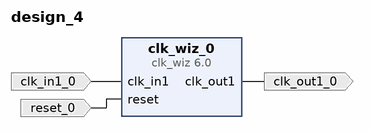
[diagram p0: block diagram of the top level]
# Vivado block design design_4, xc7a35tcpg236-1, Vivado 2024.2
create_bd_design design_4

create_bd_port -dir I -type clk clk_in1_0
set_property -dict {CONFIG.FREQ_HZ 12000000} [get_bd_ports clk_in1_0]
create_bd_port -dir O -type clk clk_out1_0
create_bd_port -dir I -type rst reset_0
set_property -dict {CONFIG.POLARITY ACTIVE_HIGH} [get_bd_ports reset_0]

create_bd_cell -type ip -vlnv xilinx.com:ip:clk_wiz:6.0 clk_wiz_0
set_property -dict [list \
  CONFIG.CLKOUT1_JITTER 555.020 \
  CONFIG.CLKOUT1_PHASE_ERROR 674.235 \
  CONFIG.CLKOUT1_REQUESTED_OUT_FREQ 30 \
  CONFIG.MMCM_CLKFBOUT_MULT_F 63.750 \
  CONFIG.MMCM_CLKOUT0_DIVIDE_F 25.500 \
  CONFIG.MMCM_DIVCLK_DIVIDE 1 \
] [get_bd_cells clk_wiz_0]

# ---- connections ----

connect_bd_net -net clk_in1_0_1 [get_bd_ports clk_in1_0] [get_bd_pins clk_wiz_0/clk_in1]
connect_bd_net [get_bd_pins clk_wiz_0/clk_out1] [get_bd_ports clk_out1_0]
connect_bd_net -net reset_0_1 [get_bd_ports reset_0] [get_bd_pins clk_wiz_0/reset]

validate_bd_design
save_bd_design
